# Altium schematic sheet 22.SchDoc
size 297 x 209 mm
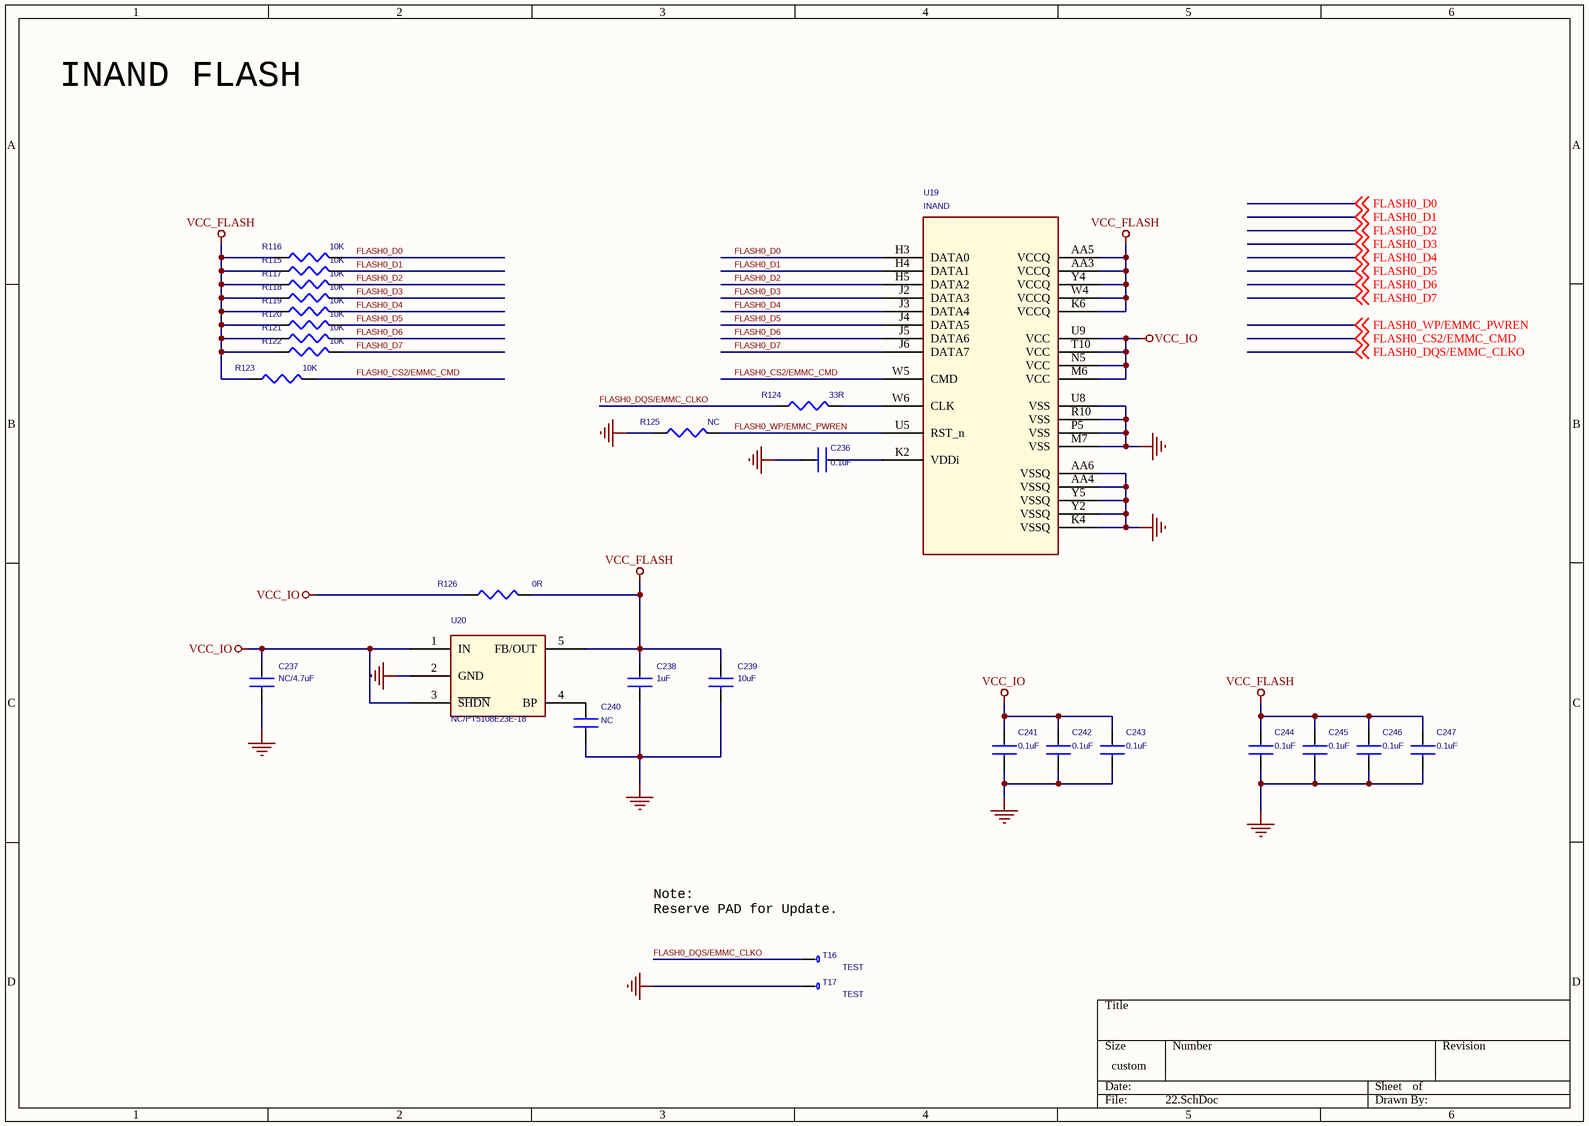
[diagram p0: 22.SchDoc]

## Parts
C236  0.1uF  [C0603]
C237  NC/4.7uF  [C0603]
C238  1uF  [C0603]
C239  10uF  [C0603]
C240  NC  [C0603]
C241  0.1uF  [C0603]
C242  0.1uF  [C0603]
C243  0.1uF  [C0603]
C244  0.1uF  [C0603]
C245  0.1uF  [C0603]
C246  0.1uF  [C0603]
C247  0.1uF  [C0603]
R115  10K  [R0402]
R116  10K  [R0402]
R117  10K  [R0402]
R118  10K  [R0402]
R119  10K  [R0402]
R120  10K  [R0402]
R121  10K  [R0402]
R122  10K  [R0402]
R123  10K  [R0402]
R124  33R  [R0402]
R125  NC  [R0402]
R126  0R  [R0402]
T16  TEST  [TEST]
T17  TEST  [TEST]
U19  INAND  [INANA-BGA169]
U20  NC/PT5108E23E-18  [SOT25]

## Nets
GND: C236.1 C237.2 C238.2 C239.2 C240.1 C241.1 C242.1 C243.1 C244.1 C245.1 C246.1 C247.1 R125.1 T17.1 U19.AA4(VSSQ) U19.AA6(VSSQ) U19.K4(VSSQ) U19.M7(VSS) U19.P5(VSS) U19.R10(VSS) U19.U8(VSS) U19.Y2(VSSQ) U19.Y5(VSSQ) U20.2(GND)
VCC_FLASH: C238.1 C239.1 C244.2 C245.2 C246.2 C247.2 R115.1 R116.1 R117.1 R118.1 R119.1 R120.1 R121.1 R122.1 R123.1 R126.2 U19.AA3(VCCQ) U19.AA5(VCCQ) U19.K6(VCCQ) U19.W4(VCCQ) U19.Y4(VCCQ) U20.5(FB/OUT)
VCC_IO: C237.1 C241.2 C242.2 C243.2 R126.1 U19.M6(VCC) U19.N5(VCC) U19.T10(VCC) U19.U9(VCC) U20.1(IN) U20.3(~{SHDN})
FLASH0_CS2/EMMC_CMD: R123.2 U19.W5(CMD) ; off-sheet FLASH0_CS2/EMMC_CMD
FLASH0_D0: R116.2 U19.H3(DATA0) ; off-sheet FLASH0_D0
FLASH0_D1: R115.2 U19.H4(DATA1) ; off-sheet FLASH0_D1
FLASH0_D2: R117.2 U19.H5(DATA2) ; off-sheet FLASH0_D2
FLASH0_D3: R118.2 U19.J2(DATA3) ; off-sheet FLASH0_D3
FLASH0_D4: R119.2 U19.J3(DATA4) ; off-sheet FLASH0_D4
FLASH0_D5: R120.2 U19.J4(DATA5) ; off-sheet FLASH0_D5
FLASH0_D6: R121.2 U19.J5(DATA6) ; off-sheet FLASH0_D6
FLASH0_D7: R122.2 U19.J6(DATA7) ; off-sheet FLASH0_D7
FLASH0_DQS/EMMC_CLKO: R124.1 T16.1 ; off-sheet FLASH0_DQS/EMMC_CLKO
FLASH0_WP/EMMC_PWREN: R125.2 U19.U5(RST_n) ; off-sheet FLASH0_WP/EMMC_PWREN
NetC236_2: C236.2 U19.K2(VDDi)
NetC240_2: C240.2 U20.4(BP)
NetR124_2: R124.2 U19.W6(CLK)

## Notes on the sheet
- INAND FLASH
- (near T16) Note:
  Reserve PAD for Update.

## Library data of the parts
C236 C240-C247 = CAP NP_Dup3: RoHS CHIP CAP 0.1uF +10/-10% X7R
C237-C239 = CAP NP_Dup3: RoHS CHIP CAP 4.7uF +10/-10% X5R
R115-R123 = RESISTOR_Dup1: ROHS CHIP RES 10K 1/16W +/-5%
R124 = RESISTOR_Dup1: NC
R125 = RESISTOR_Dup1
R126 = RESISTOR_Dup1: ROHS CHIP RES 10K 1/16W 5%
T16 T17 = TEST_1
U19 = INAND: NAND Flash,H26M54001BKR,2.7V,3.3V,3.6V,128G,N/A,-25℃~85℃,FBGA-169P
U20 = DS8008_4